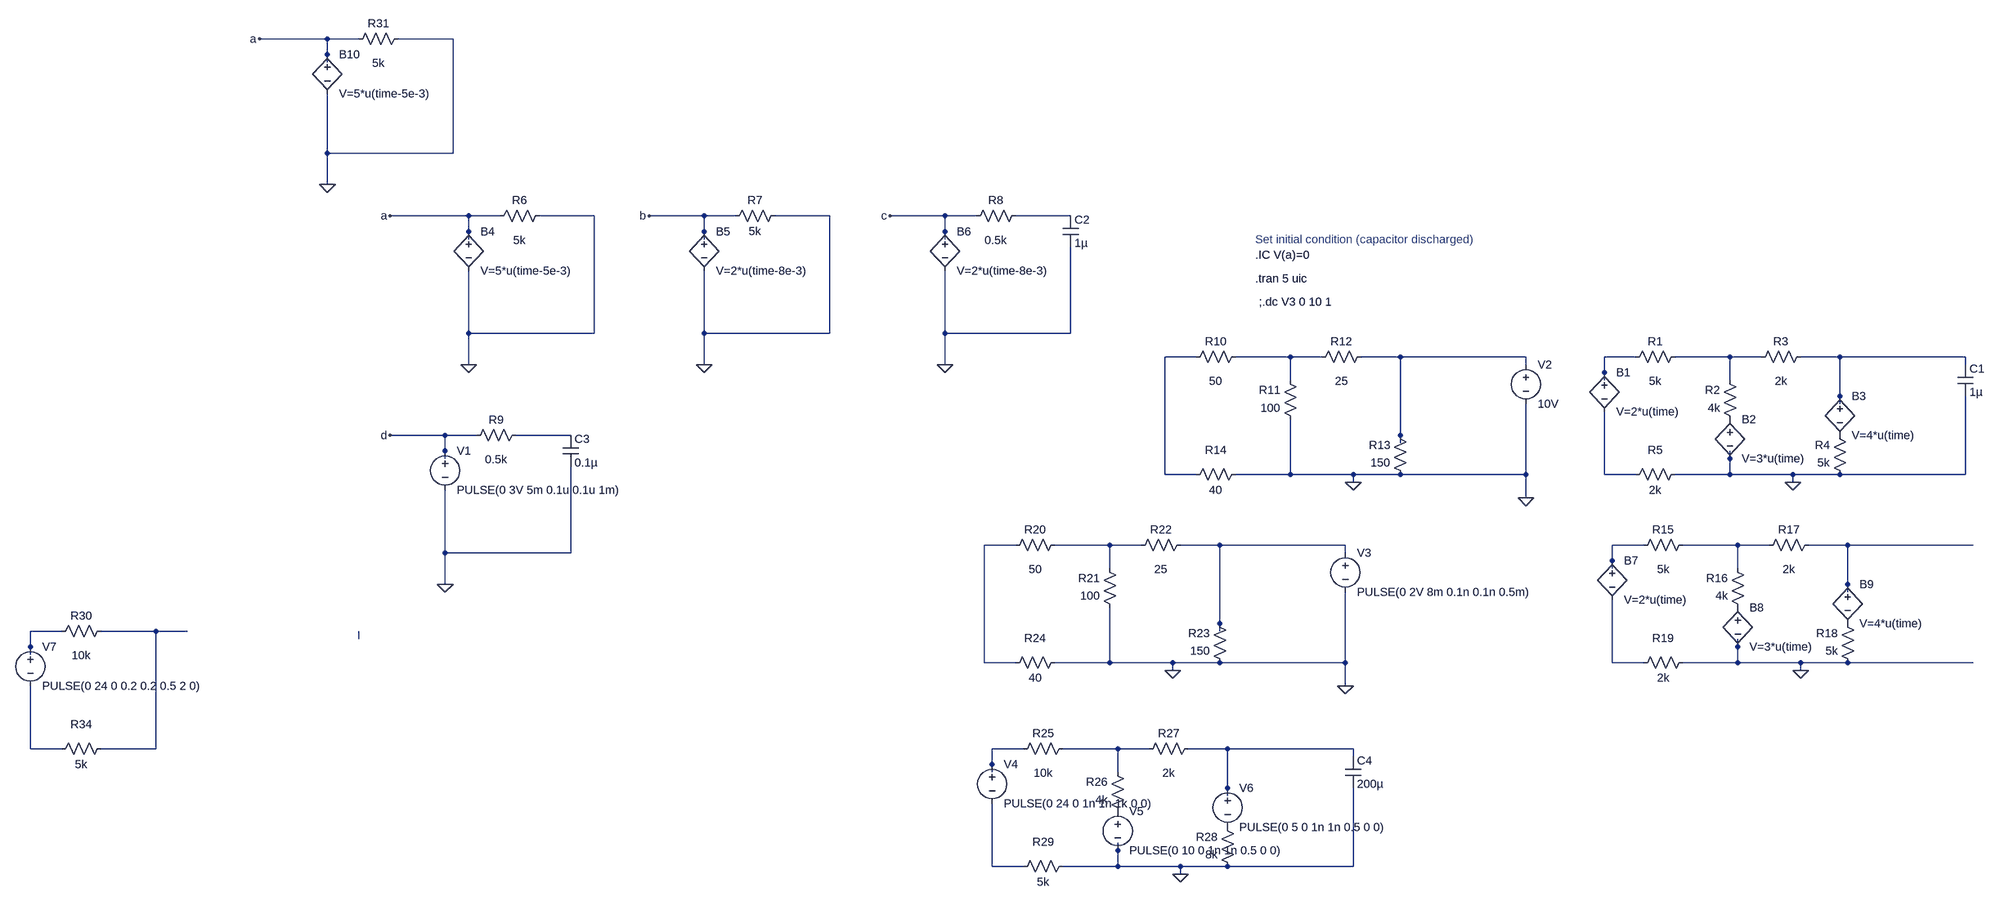
[diagram p0: schematic Thevenin.asc]
Thevenin.asc, the LTspice schematic file:
Version 4
SHEET 1 1644 864
WIRE -1760 -880 -1920 -880
WIRE -1696 -880 -1760 -880
WIRE -1504 -880 -1616 -880
WIRE -1760 -848 -1760 -880
WIRE -1760 -832 -1760 -848
WIRE -1760 -640 -1760 -768
WIRE -1504 -640 -1504 -880
WIRE -1504 -640 -1760 -640
WIRE -1760 -576 -1760 -640
WIRE -1472 -512 -1632 -512
WIRE -1408 -512 -1472 -512
WIRE -1216 -512 -1328 -512
WIRE -992 -512 -1104 -512
WIRE -928 -512 -992 -512
WIRE -736 -512 -848 -512
WIRE -496 -512 -608 -512
WIRE -432 -512 -496 -512
WIRE -240 -512 -352 -512
WIRE -1472 -480 -1472 -512
WIRE -992 -480 -992 -512
WIRE -496 -480 -496 -512
WIRE -1472 -464 -1472 -480
WIRE -992 -464 -992 -480
WIRE -496 -464 -496 -480
WIRE -1472 -272 -1472 -400
WIRE -1216 -272 -1216 -512
WIRE -1216 -272 -1472 -272
WIRE -992 -272 -992 -400
WIRE -736 -272 -736 -512
WIRE -736 -272 -992 -272
WIRE -496 -272 -496 -400
WIRE -240 -272 -240 -448
WIRE -240 -272 -496 -272
WIRE 16 -224 -48 -224
WIRE 208 -224 96 -224
WIRE 272 -224 208 -224
WIRE 432 -224 352 -224
WIRE 688 -224 432 -224
WIRE 912 -224 848 -224
WIRE 1104 -224 992 -224
WIRE 1168 -224 1104 -224
WIRE 1328 -224 1248 -224
WIRE 1584 -224 1328 -224
WIRE -1472 -208 -1472 -272
WIRE -992 -208 -992 -272
WIRE -496 -208 -496 -272
WIRE 688 -208 688 -224
WIRE 1584 -208 1584 -224
WIRE 848 -192 848 -224
WIRE 208 -176 208 -224
WIRE 848 -176 848 -192
WIRE 1104 -176 1104 -224
WIRE 1328 -144 1328 -224
WIRE 1328 -128 1328 -144
WIRE -1520 -64 -1632 -64
WIRE -1456 -64 -1520 -64
WIRE -1264 -64 -1376 -64
WIRE 432 -64 432 -224
WIRE 432 -48 432 -64
WIRE -1520 -32 -1520 -64
WIRE -1520 -16 -1520 -32
WIRE 1104 -16 1104 -32
WIRE -48 16 -48 -224
WIRE 16 16 -48 16
WIRE 208 16 208 -96
WIRE 208 16 96 16
WIRE 336 16 208 16
WIRE 432 16 336 16
WIRE 688 16 688 -128
WIRE 688 16 432 16
WIRE 848 16 848 -112
WIRE 912 16 848 16
WIRE 1104 16 1104 -16
WIRE 1104 16 992 16
WIRE 1232 16 1104 16
WIRE 1328 16 1232 16
WIRE 1584 16 1584 -144
WIRE 1584 16 1328 16
WIRE 336 32 336 16
WIRE 1232 32 1232 16
WIRE 688 64 688 16
WIRE -352 160 -416 160
WIRE -160 160 -272 160
WIRE -96 160 -160 160
WIRE 64 160 -16 160
WIRE 320 160 64 160
WIRE 928 160 864 160
WIRE 1120 160 1008 160
WIRE 1184 160 1120 160
WIRE 1344 160 1264 160
WIRE 1600 160 1344 160
WIRE -1520 176 -1520 48
WIRE -1264 176 -1264 0
WIRE -1264 176 -1520 176
WIRE 320 176 320 160
WIRE 864 192 864 160
WIRE -160 208 -160 160
WIRE 864 208 864 192
WIRE 1120 208 1120 160
WIRE -1520 240 -1520 176
WIRE 1344 240 1344 160
WIRE 1344 256 1344 240
WIRE 64 320 64 160
WIRE -2368 336 -2432 336
WIRE -2176 336 -2288 336
WIRE -2112 336 -2176 336
WIRE 64 336 64 320
WIRE -1696 352 -1696 336
WIRE -2432 368 -2432 336
WIRE 1120 368 1120 352
WIRE -2432 384 -2432 368
WIRE -416 400 -416 160
WIRE -352 400 -416 400
WIRE -160 400 -160 288
WIRE -160 400 -272 400
WIRE -32 400 -160 400
WIRE 64 400 -32 400
WIRE 320 400 320 256
WIRE 320 400 64 400
WIRE 864 400 864 272
WIRE 928 400 864 400
WIRE 1120 400 1120 368
WIRE 1120 400 1008 400
WIRE 1248 400 1120 400
WIRE 1344 400 1248 400
WIRE 1600 400 1344 400
WIRE -32 416 -32 400
WIRE 1248 416 1248 400
WIRE 320 448 320 400
WIRE -2432 576 -2432 448
WIRE -2368 576 -2432 576
WIRE -2176 576 -2176 336
WIRE -2176 576 -2288 576
WIRE -336 576 -400 576
WIRE -144 576 -256 576
WIRE -80 576 -144 576
WIRE 80 576 0 576
WIRE 336 576 80 576
WIRE 336 592 336 576
WIRE -400 608 -400 576
WIRE -400 624 -400 608
WIRE -144 624 -144 576
WIRE 80 656 80 576
WIRE 80 672 80 656
WIRE -144 784 -144 768
WIRE -400 816 -400 688
WIRE -336 816 -400 816
WIRE -144 816 -144 784
WIRE -144 816 -256 816
WIRE -16 816 -144 816
WIRE 80 816 -16 816
WIRE 336 816 336 656
WIRE 336 816 80 816
WIRE -16 832 -16 816
FLAG 1232 32 0
FLAG -1472 -208 0
FLAG -992 -208 0
FLAG -1632 -512 a
FLAG -1104 -512 b
FLAG -496 -208 0
FLAG -608 -512 c
FLAG -1520 240 0
FLAG -1632 -64 d
FLAG 336 32 0
FLAG 1248 416 0
FLAG 688 64 0
FLAG -32 416 0
FLAG 320 448 0
FLAG -16 832 0
FLAG -1760 -576 0
FLAG -1920 -880 a
SYMBOL res 896 -208 R270
WINDOW 0 32 56 VTop 2
WINDOW 3 -18 56 VBottom 2
SYMATTR InstName R1
SYMATTR Value 5k
SYMBOL res 1120 -80 R180
WINDOW 0 36 76 Left 2
WINDOW 3 36 40 Left 2
SYMATTR InstName R2
SYMATTR Value 4k
SYMBOL res 1152 -208 R270
WINDOW 0 32 56 VTop 2
WINDOW 3 -18 56 VBottom 2
SYMATTR InstName R3
SYMATTR Value 2k
SYMBOL res 1344 32 R180
WINDOW 0 36 76 Left 2
WINDOW 3 36 40 Left 2
SYMATTR InstName R4
SYMATTR Value 5k
SYMBOL res 1008 0 R90
WINDOW 0 -18 56 VBottom 2
WINDOW 3 32 56 VTop 2
SYMATTR InstName R5
SYMATTR Value 2k
SYMBOL cap 1568 -208 R0
SYMATTR InstName C1
SYMATTR Value 1µ
SYMBOL bv 848 -208 R0
SYMATTR InstName B1
SYMATTR Value V=2*u(time)
SYMBOL bv 1104 -112 R0
SYMATTR InstName B2
SYMATTR Value V=3*u(time)
SYMBOL bv 1328 -160 R0
SYMATTR InstName B3
SYMATTR Value V=4*u(time)
SYMBOL res -1424 -496 R270
WINDOW 0 32 56 VTop 2
WINDOW 3 -18 56 VBottom 2
SYMATTR InstName R6
SYMATTR Value 5k
SYMBOL bv -1472 -496 R0
SYMATTR InstName B4
SYMATTR Value V=5*u(time-5e-3)
SYMBOL res -832 -528 R90
WINDOW 0 0 56 VBottom 2
WINDOW 3 32 56 VTop 2
SYMATTR InstName R7
SYMATTR Value 5k
SYMBOL bv -992 -496 R0
SYMATTR InstName B5
SYMATTR Value V=2*u(time-8e-3)
SYMBOL res -448 -496 R270
WINDOW 0 32 56 VTop 2
WINDOW 3 -18 56 VBottom 2
SYMATTR InstName R8
SYMATTR Value 0.5k
SYMBOL bv -496 -496 R0
SYMATTR InstName B6
SYMATTR Value V=2*u(time-8e-3)
SYMBOL cap -256 -512 R0
SYMATTR InstName C2
SYMATTR Value 1µ
SYMBOL res -1472 -48 R270
WINDOW 0 32 56 VTop 2
WINDOW 3 -18 56 VBottom 2
SYMATTR InstName R9
SYMATTR Value 0.5k
SYMBOL cap -1280 -64 R0
SYMATTR InstName C3
SYMATTR Value 0.1µ
SYMBOL voltage -1520 -48 R0
WINDOW 123 0 0 Left 0
WINDOW 39 0 0 Left 0
SYMATTR InstName V1
SYMATTR Value PULSE(0 3V 5m 0.1u 0.1u 1m)
SYMBOL res 0 -208 R270
WINDOW 0 32 56 VTop 2
WINDOW 3 -18 56 VBottom 2
SYMATTR InstName R10
SYMATTR Value 50
SYMBOL res 224 -80 R180
WINDOW 0 36 76 Left 2
WINDOW 3 36 40 Left 2
SYMATTR InstName R11
SYMATTR Value 100
SYMBOL res 256 -208 R270
WINDOW 0 32 56 VTop 2
WINDOW 3 -18 56 VBottom 2
SYMATTR InstName R12
SYMATTR Value 25
SYMBOL res 448 32 R180
WINDOW 0 36 76 Left 2
WINDOW 3 36 40 Left 2
SYMATTR InstName R13
SYMATTR Value 150
SYMBOL res 112 0 R90
WINDOW 0 -18 56 VBottom 2
WINDOW 3 32 56 VTop 2
SYMATTR InstName R14
SYMATTR Value 40
SYMBOL res 912 176 R270
WINDOW 0 32 56 VTop 2
WINDOW 3 -18 56 VBottom 2
SYMATTR InstName R15
SYMATTR Value 5k
SYMBOL res 1136 304 R180
WINDOW 0 36 76 Left 2
WINDOW 3 36 40 Left 2
SYMATTR InstName R16
SYMATTR Value 4k
SYMBOL res 1168 176 R270
WINDOW 0 32 56 VTop 2
WINDOW 3 -18 56 VBottom 2
SYMATTR InstName R17
SYMATTR Value 2k
SYMBOL res 1360 416 R180
WINDOW 0 36 76 Left 2
WINDOW 3 36 40 Left 2
SYMATTR InstName R18
SYMATTR Value 5k
SYMBOL res 1024 384 R90
WINDOW 0 -18 56 VBottom 2
WINDOW 3 32 56 VTop 2
SYMATTR InstName R19
SYMATTR Value 2k
SYMBOL bv 864 176 R0
SYMATTR InstName B7
SYMATTR Value V=2*u(time)
SYMBOL bv 1120 272 R0
SYMATTR InstName B8
SYMATTR Value V=3*u(time)
SYMBOL bv 1344 224 R0
SYMATTR InstName B9
SYMATTR Value V=4*u(time)
SYMBOL voltage 688 -224 R0
WINDOW 123 0 0 Left 0
WINDOW 39 0 0 Left 0
SYMATTR InstName V2
SYMATTR Value 10V
SYMBOL res -368 176 R270
WINDOW 0 32 56 VTop 2
WINDOW 3 -18 56 VBottom 2
SYMATTR InstName R20
SYMATTR Value 50
SYMBOL res -144 304 R180
WINDOW 0 36 76 Left 2
WINDOW 3 36 40 Left 2
SYMATTR InstName R21
SYMATTR Value 100
SYMBOL res -112 176 R270
WINDOW 0 32 56 VTop 2
WINDOW 3 -18 56 VBottom 2
SYMATTR InstName R22
SYMATTR Value 25
SYMBOL res 80 416 R180
WINDOW 0 36 76 Left 2
WINDOW 3 36 40 Left 2
SYMATTR InstName R23
SYMATTR Value 150
SYMBOL res -256 384 R90
WINDOW 0 -18 56 VBottom 2
WINDOW 3 32 56 VTop 2
SYMATTR InstName R24
SYMATTR Value 40
SYMBOL voltage 320 160 R0
WINDOW 123 0 0 Left 0
WINDOW 39 0 0 Left 0
SYMATTR InstName V3
SYMATTR Value PULSE(0 2V 8m 0.1n 0.1n 0.5m)
SYMBOL res -352 592 R270
WINDOW 0 32 56 VTop 2
WINDOW 3 -18 56 VBottom 2
SYMATTR InstName R25
SYMATTR Value 10k
SYMBOL res -128 720 R180
WINDOW 0 36 76 Left 2
WINDOW 3 36 40 Left 2
SYMATTR InstName R26
SYMATTR Value 4k
SYMBOL res -96 592 R270
WINDOW 0 32 56 VTop 2
WINDOW 3 -18 56 VBottom 2
SYMATTR InstName R27
SYMATTR Value 2k
SYMBOL res 96 832 R180
WINDOW 0 36 76 Left 2
WINDOW 3 36 40 Left 2
SYMATTR InstName R28
SYMATTR Value 8k
SYMBOL res -240 800 R90
WINDOW 0 -18 56 VBottom 2
WINDOW 3 32 56 VTop 2
SYMATTR InstName R29
SYMATTR Value 5k
SYMBOL cap 320 592 R0
SYMATTR InstName C4
SYMATTR Value 200µ
SYMBOL voltage -400 592 R0
WINDOW 123 0 0 Left 0
WINDOW 39 0 0 Left 0
SYMATTR InstName V4
SYMATTR Value PULSE(0 24 0 1n 1n 1k 0 0)
SYMBOL voltage -144 688 R0
SYMATTR InstName V5
SYMATTR Value PULSE(0 10 0 1n 1n 0.5 0 0)
SYMBOL voltage 80 640 R0
SYMATTR InstName V6
SYMATTR Value PULSE(0 5 0 1n 1n 0.5 0 0)
SYMBOL res -2384 352 R270
WINDOW 0 32 56 VTop 2
WINDOW 3 -18 56 VBottom 2
SYMATTR InstName R30
SYMATTR Value 10k
SYMBOL res -2272 560 R90
WINDOW 0 -18 56 VBottom 2
WINDOW 3 32 56 VTop 2
SYMATTR InstName R34
SYMATTR Value 5k
SYMBOL voltage -2432 352 R0
WINDOW 123 0 0 Left 0
WINDOW 39 0 0 Left 0
SYMATTR InstName V7
SYMATTR Value PULSE(0 24 0 0.2 0.2 0.5 2 0)
SYMBOL res -1712 -864 R270
WINDOW 0 32 56 VTop 2
WINDOW 3 -18 56 VBottom 2
SYMATTR InstName R31
SYMATTR Value 5k
SYMBOL bv -1760 -864 R0
SYMATTR InstName B10
SYMATTR Value V=5*u(time-5e-3)
TEXT 136 -384 Left 2 !.tran 5 uic
TEXT 136 -464 Left 2 ;Set initial condition (capacitor discharged)
TEXT 136 -432 Left 2 !.IC V(a)=0
TEXT 144 -336 Left 2 !;.dc V3 0 10 1

The netlist it stands for:
* Thevenin.asc
R1 N005 N006 5k
R2 P001 N006 4k
R3 N006 N007 2k
R4 0 P002 5k
R5 0 N009 2k
C1 N007 0 1µ
B1 N005 N009 V=2*u(time)
B2 P001 0 V=3*u(time)
B3 N007 P002 V=4*u(time)
R6 a 0 5k
B4 a 0 V=5*u(time-5e-3)
R7 0 b 5k
B5 b 0 V=2*u(time-8e-3)
R8 c N001 0.5k
B6 c 0 V=2*u(time-8e-3)
C2 N001 0 1µ
R9 d N008 0.5k
C3 N008 0 0.1µ
V1 d 0 PULSE(0 3V 5m 0.1u 0.1u 1m)
R10 N002 N003 50
R11 0 N003 100
R12 N003 N004 25
R13 0 N004 150
R14 0 N002 40
R15 N013 N014 5k
R16 P003 N014 4k
R17 N014 N015 2k
R18 0 P004 5k
R19 0 N019 2k
B7 N013 N019 V=2*u(time)
B8 P003 0 V=3*u(time)
B9 N015 P004 V=4*u(time)
V2 N004 0 10V
R20 N010 N011 50
R21 0 N011 100
R22 N011 N012 25
R23 0 N012 150
R24 0 N010 40
V3 N012 0 PULSE(0 2V 8m 0.1n 0.1n 0.5m)
R25 N021 N022 10k
R26 P005 N022 4k
R27 N022 N023 2k
R28 0 P006 8k
R29 0 N024 5k
C4 N023 0 200µ
V4 N021 N024 PULSE(0 24 0 1n 1n 1k 0 0)
V5 P005 0 PULSE(0 10 0 1n 1n 0.5 0 0)
V6 N023 P006 PULSE(0 5 0 1n 1n 0.5 0 0)
R30 N016 N017 10k
R34 N017 N020 5k
V7 N016 N020 PULSE(0 24 0 0.2 0.2 0.5 2 0)
R31 a 0 5k
B10 a 0 V=5*u(time-5e-3)
.tran 5 uic
* Set initial condition (capacitor discharged)
.IC V(a)=0
;.dc V3 0 10 1
.backanno
.end